# Altium schematic sheet CH32V203G6U6-R0.SchDoc
size 304 x 203 mm; SheetNumber: 0; SheetTotal: 0
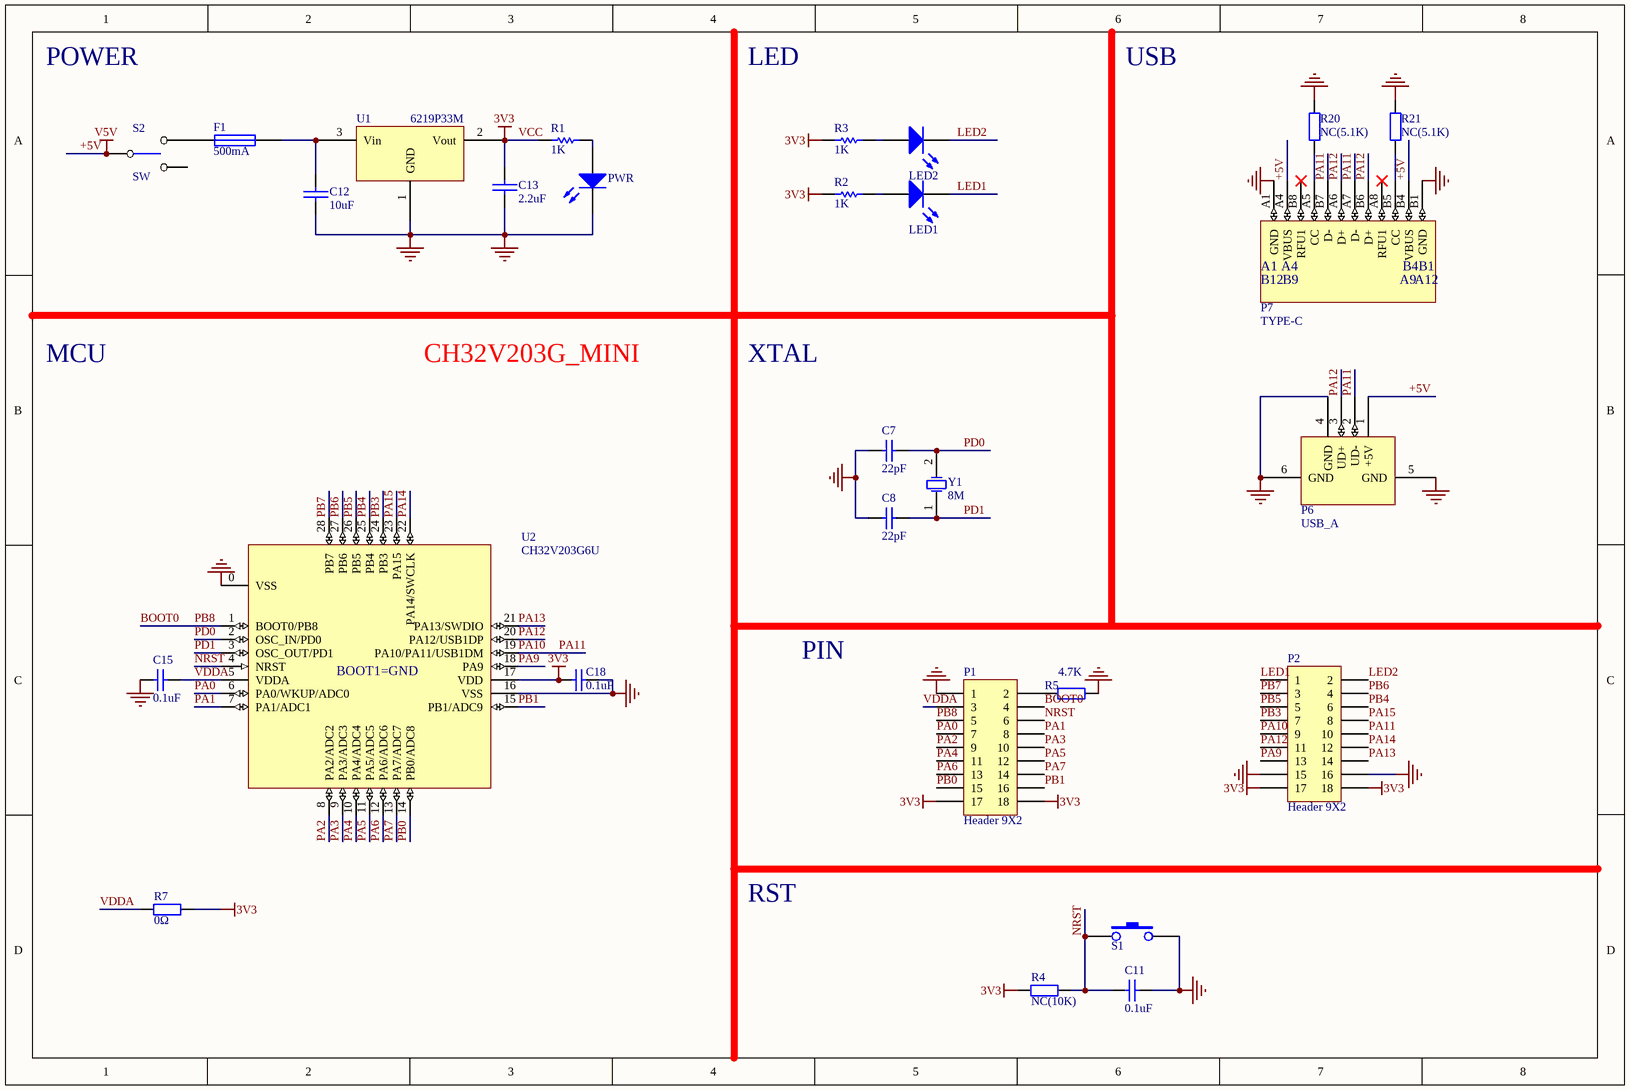
[diagram p0: CH32V203G6U6-R0.SchDoc]

## Parts
C7  22pF  [0603_C]
C8  22pF  [0603_C]
C11  0.1uF  [0603_C]
C12  10uF  [3216_C]
C13  2.2uF  [0603_C]
C15  0.1uF  [0603_C]
C18  0.1uF  [0603_C]
F1  500mA  [0603]
LED1  LED1   blue  [0603+]  (value not drawn)
LED2  LED2  blue  [0603+]  (value not drawn)
P1  Header 9X2  [IDC18-2.54MM]
P2  Header 9X2  [IDC18-2.54MM]
P6  USB_A  [USBAF]
P7  TYPE-C  [TYPE-C-Receptacle-2.0]
PWR  POWER  red  [0603+]  (value not drawn)
R1  1K  [0603]
R2  1K  [0603]
R3  1K  [0603]
R4  NC(10K)  [0603]
R5  4.7K  [0603]
R7  0Ω  [0603]
R20  NC(5.1K)  [0603]
R21  NC(5.1K)  [0603]
S1  RST  [SMD_6.1x3.65x2.5mm-KEY]  (value not drawn)
S2  SW  [KEY2]
U1  6219P33M  [SOT-23]
U2  CH32V203G6U  [QFN28_4x4]
Y1  8M  [XT_AT49]

## Nets
+5V: P6.1(+5V) P7.A4(VBUS) P7.B4(VBUS) S2.1  [also labelled V5V]
GND: C7.1 C8.1 C11.1 C12.2 C13.1 C15.2 C18.1 P1.1 P2.15 P2.16 P6.4(GND) P6.5(GND) P6.6(GND) P7.A1(GND) P7.B1(GND) PWR.2(K) R5.2 R20.2 R21.2 S1.2 U1.1(GND) U2.0(VSS) U2.16(VSS)
VCC: C13.2 C18.2 P1.17 P1.18 P2.17 P2.18 R1.2 R2.1 R3.1 R4.2 R7.1 U1.2(Vout) U2.17(VDD)  [also labelled 3V3]
BOOT0: P1.4 P1.5 U2.1(BOOT0/PB8)  [also labelled PB8]
LED1: LED1.2(K) P2.1
LED2: LED2.2(K) P2.2
NRST: C11.2 P1.6 R4.1 S1.1 U2.4(NRST)
PA0: P1.7 U2.6(PA0/WKUP/ADC0)
PA1: P1.8 U2.7(PA1/ADC1)
PA2: P1.9 U2.8(PA2/ADC2)
PA3: P1.10 U2.9(PA3/ADC3)
PA4: P1.11 U2.10(PA4/ADC4)
PA5: P1.12 U2.11(PA5/ADC5)
PA6: P1.13 U2.12(PA6/ADC6)
PA7: P1.14 U2.13(PA7/ADC7)
PA9: P2.13 U2.18(PA9)
PA10: P2.9 P2.10 P6.2(UD-) P7.A7(D-) P7.B7(D-) U2.19(PA10/PA11/USB1DM)  [also labelled PA11]
PA12: P2.11 P6.3(UD+) P7.A6(D+) P7.B6(D+) U2.20(PA12/USB1DP)
PA13: P2.14 U2.21(PA13/SWDIO)
PA14: P2.12 U2.22(PA14/SWCLK)
PA15: P2.8 U2.23(PA15)
PB0: P1.15 U2.14(PB0/ADC8)
PB1: P1.16 U2.15(PB1/ADC9)
PB3: P2.7 U2.24(PB3)
PB4: P2.6 U2.25(PB4)
PB5: P2.5 U2.26(PB5)
PB6: P2.4 U2.27(PB6)
PB7: P2.3 U2.28(PB7)
PD0: C7.2 U2.2(OSC_IN/PD0) Y1.2(OSC2)
PD1: C8.2 U2.3(OSC_OUT/PD1) Y1.1(OSC1)
VDDA: C15.1 P1.3 R7.2 U2.5(VDDA)
NetC12_1: C12.1 F1.2 U1.3(Vin)
NetF1_1: F1.1 S2.3
NetLED1_1: LED1.1(A) R2.2
NetLED2_1: LED2.1(A) R3.2
NetP1_2: P1.2 R5.1
NetP7_A5: P7.A5(CC) R20.1
NetP7_B5: P7.B5(CC) R21.1
NetPWR_1: PWR.1(A) R1.1

Not connected (* = marked no-connect by the designer): P7 A8(RFU1)* B8(RFU1)*; S2 2

## Notes on the sheet
- POWER
- LED
- USB
- MCU
- CH32V203G_MINI
- XTAL
- PIN
- RST
- Title
- Size:
- Date:
- A3
- Number:
- Time:
- Revision:
- Sheet
- of
- File:
- (in symbol CH32V203G6U) BOOT1=GND
- (in symbol TYPE-C1) B12; B9; A9; A12

## Library data of the parts
C7 C8 C11 C18 = Cap: Capacitor; Published: 8-Jun-2000; LatestRevisionDate: 17-Jul-2002; LatestRevisionNote: Re-released for DXP Platform.; PackageReference: RAD-0.3; Publisher: Altium Limited
  C11: Value: 0.1uF
C12 C13 = CAP: Capacitor
C15 = Cap: Capacitor; Value: 15pF; Published: 8-Jun-2000; LatestRevisionDate: 17-Jul-2002; LatestRevisionNote: Re-released for DXP Platform.; PackageReference: RAD-0.3; Publisher: Altium Limited
F1 = FUSE1: Fuse
LED1 LED2 PWR = LED0: Typical INFRARED GaAs LED; Published: 8-Jun-2000; LatestRevisionDate: 08-Jul-2005; LatestRevisionNote: Mech Layer 1 removed.; PackageReference: LED-0; Publisher: Altium Limited
P1 P2 = Header 9X2: Header, 9-Pin, Dual row; LatestRevisionDate: 17-Jul-2002; LatestRevisionNote: Re-released for DXP Platform.; Publisher: Altium Limited
P6 = USB: USB Port
P7 = TYPE-C1
R1-R3 = Res Semi: Semiconductor Resistor; Published: 8-Jun-2000; LatestRevisionDate: 17-Jul-2002; LatestRevisionNote: Re-released for DXP Platform.; PackageReference: AXIAL-0.5; Publisher: Altium Limited; Value: 1K
R4 R7 R20 R21 = Res2: Resistor
  R4: Published: 8-Jun-2000; LatestRevisionDate: 17-Jul-2002; LatestRevisionNote: Re-released for DXP Platform.; PackageReference: AXIAL-0.4; Publisher: Altium Limited; Value: 10K
  R7: Published: 8-Jun-2000; LatestRevisionDate: 17-Jul-2002; LatestRevisionNote: Re-released for DXP Platform.; PackageReference: AXIAL-0.4; Publisher: Altium Limited
R5 = Res2: Resistor; Value: 10K; Published: 8-Jun-2000; LatestRevisionDate: 17-Jul-2002; LatestRevisionNote: Re-released for DXP Platform.; PackageReference: AXIAL-0.4; Publisher: Altium Limited
S1 = KEY
U2 = CH32V203G6U: RISC-V LMD-MCU, 144MHz, USB FS, CAN, Mul-ADC,OPA
Y1 = XTAL: Crystal Oscillator; Published: 8-Jun-2000; LatestRevisionDate: 17-Jul-2002; LatestRevisionNote: Re-released for DXP Platform.; PackageReference: R38; Publisher: Altium Limited